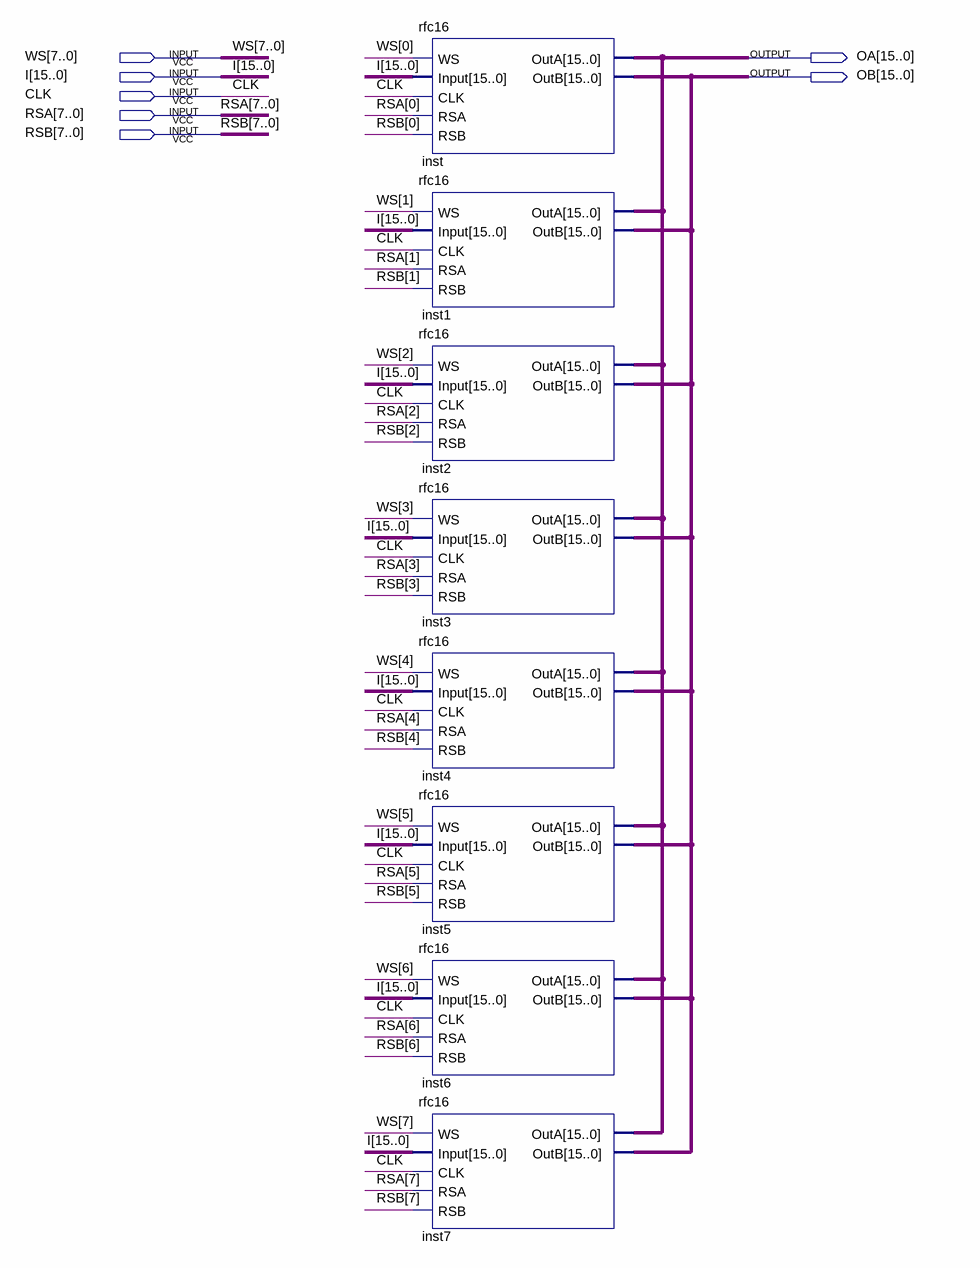
[diagram p0: schematic sheet]
// Quartus schematic rfc8x16.bdf as structural Verilog: 8 symbols, 7 pins
module rfc8x16 (
  input  [7:0] WS,
  input  [15:0] I,
  input  CLK,
  input  [7:0] RSA,
  input  [7:0] RSB,
  output [15:0] OA,
  output [15:0] OB
);

  rfc16 inst (.WS(WS[0]), .Input(I), .CLK(CLK), .RSA(RSA[0]), .RSB(RSB[0]), .OutA(OA), .OutB(OB));
  rfc16 inst1 (.WS(WS[1]), .Input(I), .CLK(CLK), .RSA(RSA[1]), .RSB(RSB[1]), .OutA(OA), .OutB(OB));
  rfc16 inst2 (.WS(WS[2]), .Input(I), .CLK(CLK), .RSA(RSA[2]), .RSB(RSB[2]), .OutA(OA), .OutB(OB));
  rfc16 inst3 (.WS(WS[3]), .Input(I), .CLK(CLK), .RSA(RSA[3]), .RSB(RSB[3]), .OutA(OA), .OutB(OB));
  rfc16 inst4 (.WS(WS[4]), .Input(I), .CLK(CLK), .RSA(RSA[4]), .RSB(RSB[4]), .OutA(OA), .OutB(OB));
  rfc16 inst5 (.WS(WS[5]), .Input(I), .CLK(CLK), .RSA(RSA[5]), .RSB(RSB[5]), .OutA(OA), .OutB(OB));
  rfc16 inst6 (.WS(WS[6]), .Input(I), .CLK(CLK), .RSA(RSA[6]), .RSB(RSB[6]), .OutA(OA), .OutB(OB));
  rfc16 inst7 (.WS(WS[7]), .Input(I), .CLK(CLK), .RSA(RSA[7]), .RSB(RSB[7]), .OutA(OA), .OutB(OB));
endmodule
